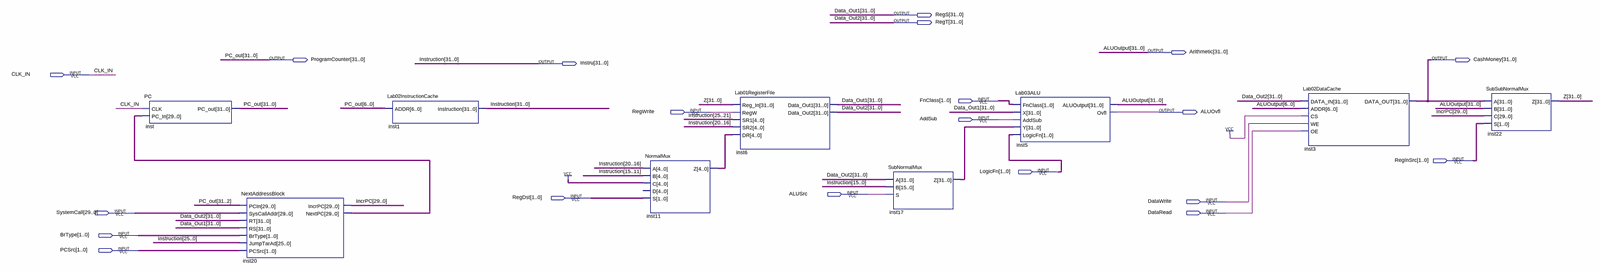
[diagram p0: schematic sheet, whole]
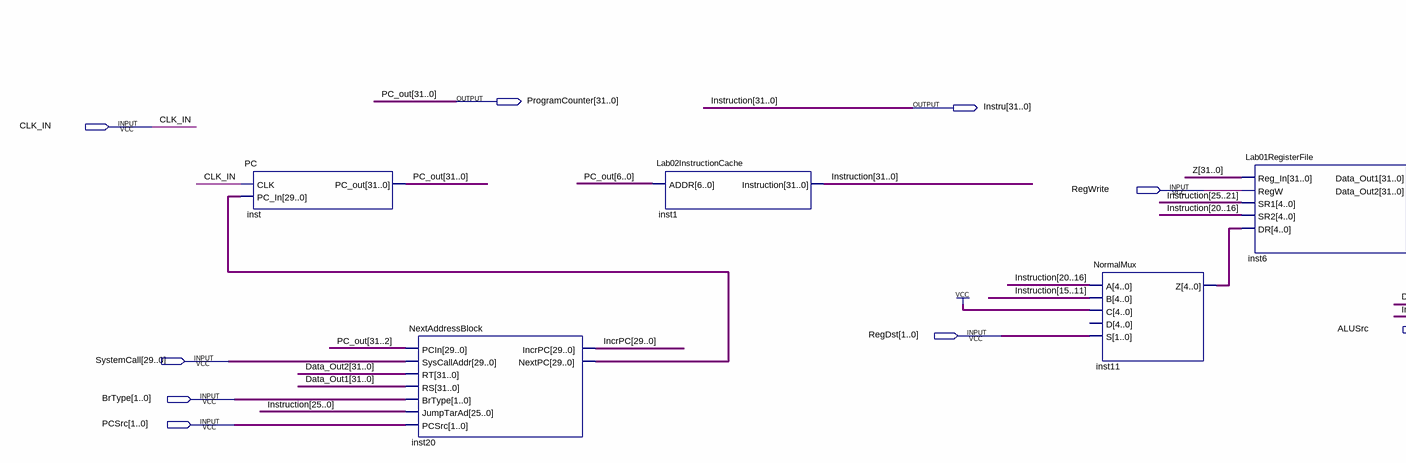
[diagram p1: schematic sheet, left part]
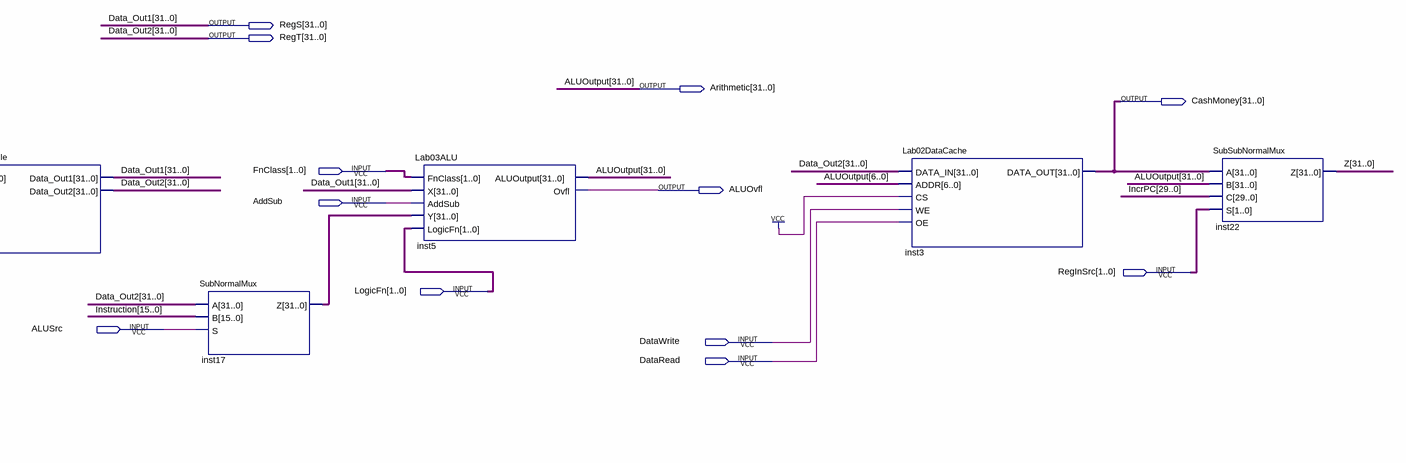
[diagram p2: schematic sheet, right part]
// Quartus schematic Lab02MainFile.bdf as structural Verilog: 9 symbols, 20 pins
module Lab02MainFile (
  input  CLK_IN,
  input  [1:0] FnClass,
  input  RegWrite,
  input  AddSub,
  input  [1:0] RegInSrc,
  input  [1:0] LogicFn,
  input  ALUSrc,
  input  [1:0] RegDst,
  input  DataWrite,
  input  [29:0] SystemCall,
  input  DataRead,
  input  [1:0] BrType,
  input  [1:0] PCSrc,
  output [31:0] RegS,
  output [31:0] RegT,
  output [31:0] Arithmetic,
  output [31:0] ProgramCounter,
  output [31:0] CashMoney,
  output [31:0] Instru,
  output ALUOvfl
);

  wire [4:0] inst11_z;
  wire [29:0] IncrPC, inst20_nextpc;
  wire [31:0] inst17_z, Z;

  PC inst (.CLK(CLK_IN), .PC_In(inst20_nextpc), .PC_out(ProgramCounter));
  NextAddressBlock inst20 (
    .PCIn(ProgramCounter[31:2]), .SysCallAddr(SystemCall), .RT(RegT), .RS(RegS), .BrType(BrType),
    .JumpTarAd(Instru[25:0]), .PCSrc(PCSrc), .IncrPC(IncrPC), .NextPC(inst20_nextpc));
  Lab02InstructionCache inst1 (.ADDR(ProgramCounter[6:0]), .Instruction(Instru));
  NormalMux inst11 (.A(Instru[20:16]), .B(Instru[15:11]), .C({5{1'b1}}), .S(RegDst), .Z(inst11_z));  // open: D
  Lab01RegisterFile inst6 (
    .Reg_In(Z), .RegW(RegWrite), .SR1(Instru[25:21]), .SR2(Instru[20:16]), .DR(inst11_z), .Data_Out1(RegS),
    .Data_Out2(RegT));
  SubNormalMux inst17 (.A(RegT), .B(Instru[15:0]), .S(ALUSrc), .Z(inst17_z));
  Lab03ALU inst5 (
    .FnClass(FnClass), .X(RegS), .AddSub(AddSub), .Y(inst17_z), .LogicFn(LogicFn), .ALUOutput(Arithmetic),
    .Ovfl(ALUOvfl));
  Lab02DataCache inst3 (
    .DATA_IN(RegT), .ADDR(Arithmetic[6:0]), .CS(1'b1), .WE(DataWrite), .OE(DataRead), .DATA_OUT(CashMoney));
  SubSubNormalMux inst22 (.A(CashMoney), .B(Arithmetic), .C(IncrPC), .S(RegInSrc), .Z(Z));

  // Other names for the same wires on the sheet: ALUOutput[31:0] = Arithmetic; Data_Out1[31:0] = RegS;
  //   Data_Out2[31:0] = RegT; Instruction[31:0] = Instru; PC_out[31:0] = ProgramCounter
endmodule
